# EAGLE design attiny85usb_4ch (EAGLE 9.4.2)
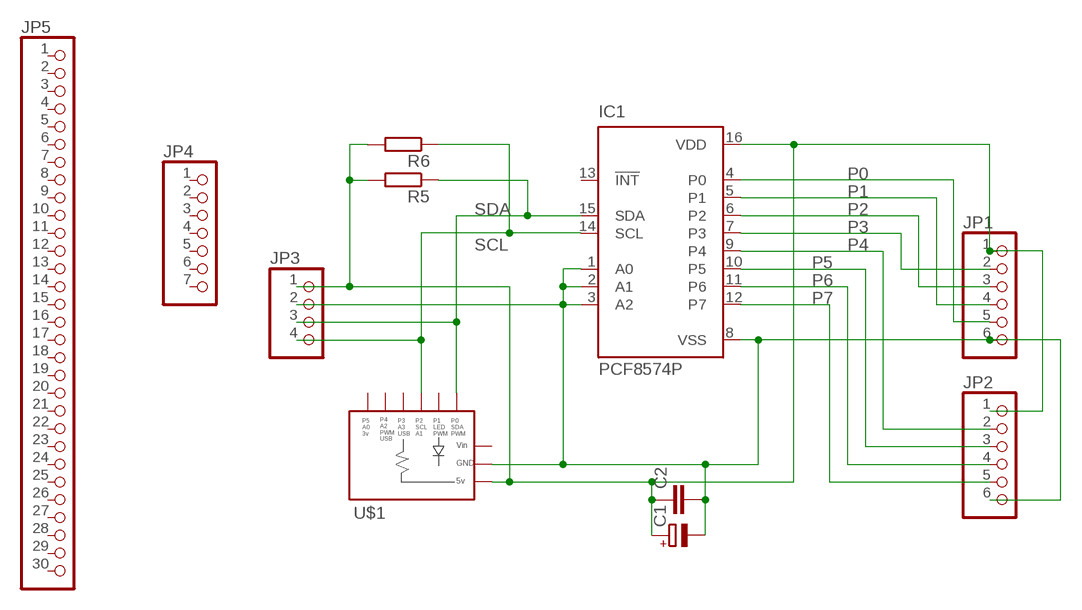
[diagram p0: schematic, sheet 1]

## Parts
C1  CPOL-EUE2-5  [E2-5]
C2  C-EU025-050X050  [C025-050X050]
IC1  PCF8574P  [DIL16]
JP1  PINHD-1X6  [1X06]
JP2  PINHD-1X6/90  [1X06/90]
JP3  PINHD-1X4/90  [1X04/90]
JP4  PINHD-1X7  [1X07]
JP5  PINHD-1X30  [1X30]
R5  R-EU_0207/10  [0207/10]
R6  R-EU_0207/10  [0207/10]
U$1  DIGISPARK  [DIGISPARK]

## Nets
GND: C1.- C2.2 IC1.1(A0) IC1.2(A1) IC1.3(A2) IC1.8(VSS) JP1.6 JP2.6 JP3.2 U$1.GND
P0: IC1.4(P0) JP1.5
P1: IC1.5(P1) JP1.4
P2: IC1.6(P2) JP1.3
P3: IC1.7(P3) JP1.2
P4: IC1.9(P4) JP2.2
P5: IC1.10(P5) JP2.3
P6: IC1.11(P6) JP2.4
P7: IC1.12(P7) JP2.5
SCL: IC1.14(SCL) JP3.4 R6.1 U$1.P2
SDA: IC1.15(SDA) JP3.3 R5.1 U$1.P0
VCC: C1.+ C2.1 IC1.16(VDD) JP1.1 JP2.1 JP3.1 R5.2 R6.2 U$1.5V
Unconnected: IC1.13(!INT) JP4.1 JP4.2 JP4.3 JP4.4 JP4.5 JP4.6 JP4.7 JP5.1 JP5.2 JP5.3 JP5.4 JP5.5 JP5.6 JP5.7 JP5.8 JP5.9 JP5.10 JP5.11 JP5.12 JP5.13 JP5.14 JP5.15 JP5.16 JP5.17 JP5.18 JP5.19 JP5.20 JP5.21 JP5.22 JP5.23 JP5.24 JP5.25 JP5.26 JP5.27 JP5.28 JP5.29 JP5.30 U$1.P1 U$1.P3 U$1.P4 U$1.P5

## Power pins joined to a net without a drawn wire
VIN: U$1.VIN

## Library data of the parts
C1 = rcl:CPOL-EU: POLARIZED CAPACITOR, European symbol; SPICEPREFIX: C
C2 = rcl:C-EU: CAPACITOR, European symbol; SPICEPREFIX: C
IC1 = micro-philips:PCF8574: I2C-Bus Remote 8-bit I/O expander http://www.semiconductors.philips.com/acrobat_download/datasheets/PCF8574_4.pdf; MPN: PCF8574PN; OC_FARNELL: 204020; OC_NEWARK: 11N8515
JP1 JP2 = pinhead:PINHD-1X6: PIN HEADER
JP3 = pinhead:PINHD-1X4: PIN HEADER
JP4 = pinhead:PINHD-1X7: PIN HEADER
JP5 = pinhead:PINHD-1X30: PIN HEADER
R5 R6 = rcl:R-EU_: RESISTOR, European symbol; SPICEPREFIX: R
U$1 = srg:DIGISPARK: Digispark http://digistump.com/wiki/digispark

## Board
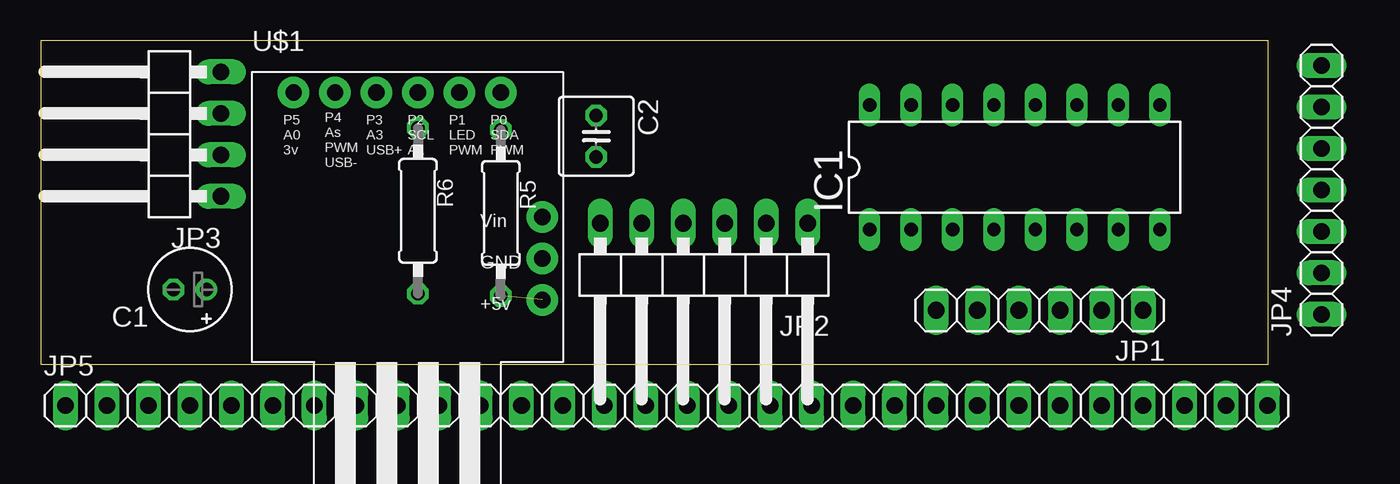
[diagram p1: board, top side]
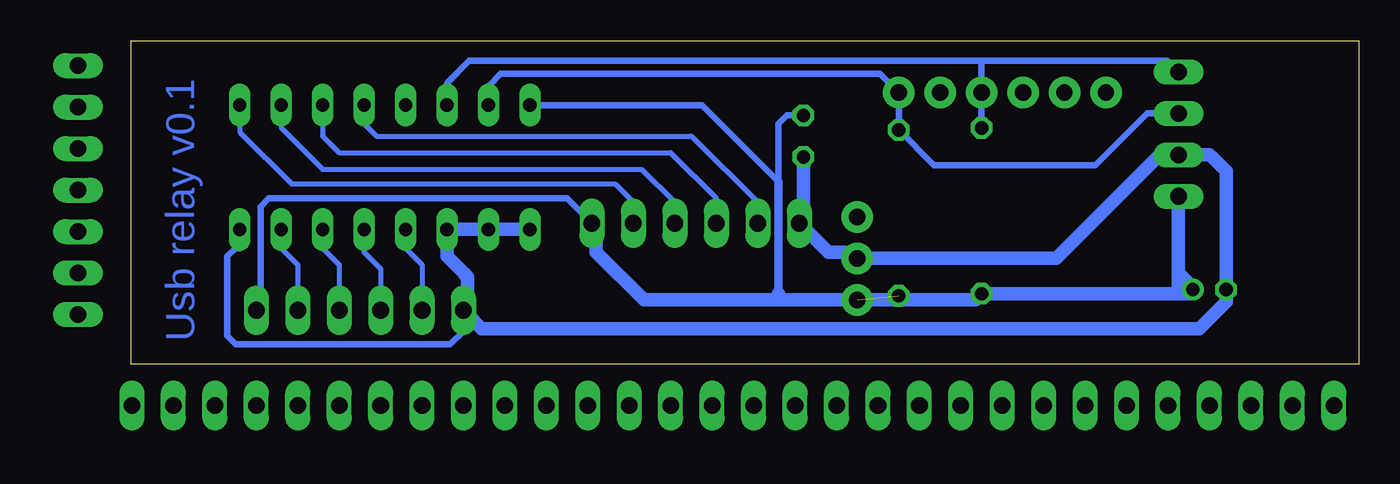
[diagram p2: board, bottom side, seen from below]

Size 75.23 x 19.8 mm. Coordinates in mm from the lower left corner, seen from the top.
Outline: 0,0 75.23,0 75.23,19.8 0,19.8 0,0
Copper layers (1*16): Top 0.035mm / dielectric 1.5mm / Bottom 0.035mm
Design rules "default": minimum track width 6mil, minimum drill 0.35mm, track to track 6mil, track to pad 6mil, pad to pad 6mil, via to via 6mil, smd to smd 6mil, copper to edge 40mil, drill to drill 6mil, minimum pad ring 10mil, minimum via ring 8mil, stop-mask expansion 4mil, vias tented up to drill 0mil, thermal gap 10mil

### Footprints (pad centres in the part's own frame; a part is rotated, then mirrored left to right if it is on the bottom)
E2-5 = drill 0.813 pad 1.27: + -1.016,0 | drill 0.813 pad 1.27 octagon: - 1.016,0
C025-050X050 = drill 0.813 octagon: 1 -1.27,0; 2 1.27,0
DIL16 = drill 0.813 long: 1 -8.89,-3.81; 2 -6.35,-3.81; 3 -3.81,-3.81; 4 -1.27,-3.81; 5 1.27,-3.81; 6 3.81,-3.81; 7 6.35,-3.81; 8 8.89,-3.81; 9 8.89,3.81; 10 6.35,3.81; 11 3.81,3.81; 12 1.27,3.81; 13 -1.27,3.81; 14 -3.81,3.81; 15 -6.35,3.81; 16 -8.89,3.81
1X06 = drill 1.016 long: 1 -6.35,0; 2 -3.81,0; 3 -1.27,0; 4 1.27,0; 5 3.81,0; 6 6.35,0
1X06/90 = drill 1.016 long: 1 -6.35,-3.81; 2 -3.81,-3.81; 3 -1.27,-3.81; 4 1.27,-3.81; 5 3.81,-3.81; 6 6.35,-3.81
1X04/90 = drill 1.016 long: 1 -3.81,-3.81; 2 -1.27,-3.81; 3 1.27,-3.81; 4 3.81,-3.81
1X07 = drill 1.016 long: 1 -7.62,0; 2 -5.08,0; 3 -2.54,0; 4 0,0; 5 2.54,0; 6 5.08,0; 7 7.62,0
1X30 = drill 1.016 long: 1 -36.83,0; 2 -34.29,0; 3 -31.75,0; 4 -29.21,0; 5 -26.67,0; 6 -24.13,0; 7 -21.59,0; 8 -19.05,0; 9 -16.51,0; 10 -13.97,0; 11 -11.43,0; 12 -8.89,0; 13 -6.35,0; 14 -3.81,0; 15 -1.27,0; 16 1.27,0; 17 3.81,0; 18 6.35,0; 19 8.89,0; 20 11.43,0; 21 13.97,0; 22 16.51,0; 23 19.05,0; 24 21.59,0; 25 24.13,0; 26 26.67,0; 27 29.21,0; 28 31.75,0; 29 34.29,0; 30 36.83,0
0207/10 = drill 0.813 octagon: 1 -5.08,0; 2 5.08,0
DIGISPARK = drill 1 pad 1.93: 5V 17.78,3.81; GND 17.78,6.35; P0 15.24,16.51; P1 12.7,16.51; P2 10.16,16.51; P3 7.62,16.51; P4 5.08,16.51; P5 2.54,16.51; VIN 17.78,8.89

### Placement (x,y rotation side)
C1  9.14,4.57 180 top
C2  34.04,13.97 270 top
IC1  59.69,12.06 0 top
JP1  61.21,3.3 180 top
JP2  40.64,4.83 180 top
JP3  7.24,14.1 90 top
JP4  78.49,10.67 90 top  (outside the outline)
JP5  38.35,-2.54 0 top
R5  28.19,9.27 270 top
R6  23.11,9.4 270 top
U$1  12.95,0.13 0 top

### Tracks (layer width: path | path; a pad name or v marks a point on that pad's centre or on a via)
GND
  Bottom 0.305: 8.13,11.81 8.13,4.83
  Bottom 0.406: JP1.6 54.86,2.03 55.68,1.22 68.83,1.22 69.34,1.73 69.34,6.6 68.83,7.11 68.58,7.11 IC1.8
  Bottom 0.508: 8.13,4.32 C1.- 8.13,4.83 | 9.14,12.83 8.95,12.64 | 12.19,12.83 JP3.2 | IC1.1 IC1.2 IC1.3 | U$1.GND 31.12,6.86 31.5,6.86 | 54.86,5.31 54.86,5.59
  Bottom 0.813: 31.5,6.86 32.51,6.86 JP2.6 34.04,8.89 C2.2 | 12.19,12.83 18.54,6.48 U$1.GND | JP3.2 9.14,12.83 | 8.95,12.64 8.13,11.81 C1.- 8.13,3.81 9.75,2.18 53.75,2.18 54.61,3.05 | JP1.6 54.61,3.05 | IC1.1 IC1.3 55.88,6.6 54.86,5.59 54.61,5.33 54.61,3.05
P0
  Bottom 0.305: IC1.4 58.42,7.11 57.4,6.1 JP1.5
P1
  Bottom 0.305: JP1.4 59.94,5.84 60.96,6.86 IC1.5
P2
  Bottom 0.305: IC1.6 63.5,7.11 62.48,6.1 JP1.3
P3
  Bottom 0.305: IC1.7 66.04,7.11 65.02,6.1 JP1.2
P4
  Bottom 0.305: IC1.9 68.58,14.22 65.41,11.05 45.59,11.05 44.45,9.91 JP2.2
P5
  Bottom 0.305: IC1.10 66.04,14.48 63.5,11.94 43.94,11.94 41.91,9.91 JP2.3
P6
  Bottom 0.305: JP2.4 39.37,10.16 42.16,12.95 62.48,12.95 63.5,13.97 IC1.11
P7
  Bottom 0.305: IC1.12 60.96,14.73 60.2,13.97 40.89,13.97 36.83,9.91 JP2.5
SCL
  Bottom 0.305: 54.52,18.63 55.88,17.27 IC1.14
  Bottom 0.406: IC1.14 55.88,17.22 54.52,18.58 23.11,18.58 | R6.1 U$1.P2 23.11,18.58 | 23.11,18.58 11.72,18.58 JP3.4
SDA
  Bottom 0.406: IC1.15 53.34,17.02 52.58,17.78 29.34,17.78 U$1.P0 R5.1 26.04,12.19 16.13,12.19 12.95,15.37 JP3.3
VCC  (1 unrouted)
  Bottom 0.406: JP2.1 48.51,10.16 66.8,10.16 67.31,9.65 67.31,3.56 JP1.1 | IC1.16 40.26,15.88 35.56,11.18 35.56,14.73 35.05,15.24 C2.1
  Bottom 0.508: U$1.5V 31.12,3.94 | 35.56,11.18 35.56,4.32
  Bottom 0.813: 11.05,5.59 10.16,4.7 C1.+ 10.41,4.32 10.92,4.32 | JP3.1 11.05,5.59 | JP2.1 46.74,8.38 46.74,6.86 43.82,3.94 35.31,3.94 | 35.31,3.94 U$1.5V 23.5,3.94 R6.2 10.92,4.32 | 35.31,3.94 35.56,4.19 35.56,4.32 | 11.05,5.59 11.05,4.44 10.92,4.32

### Text on the board
Bottom: Usb relay v0.1